# EAGLE design extruderControllerv03 (EAGLE 9.3.1)
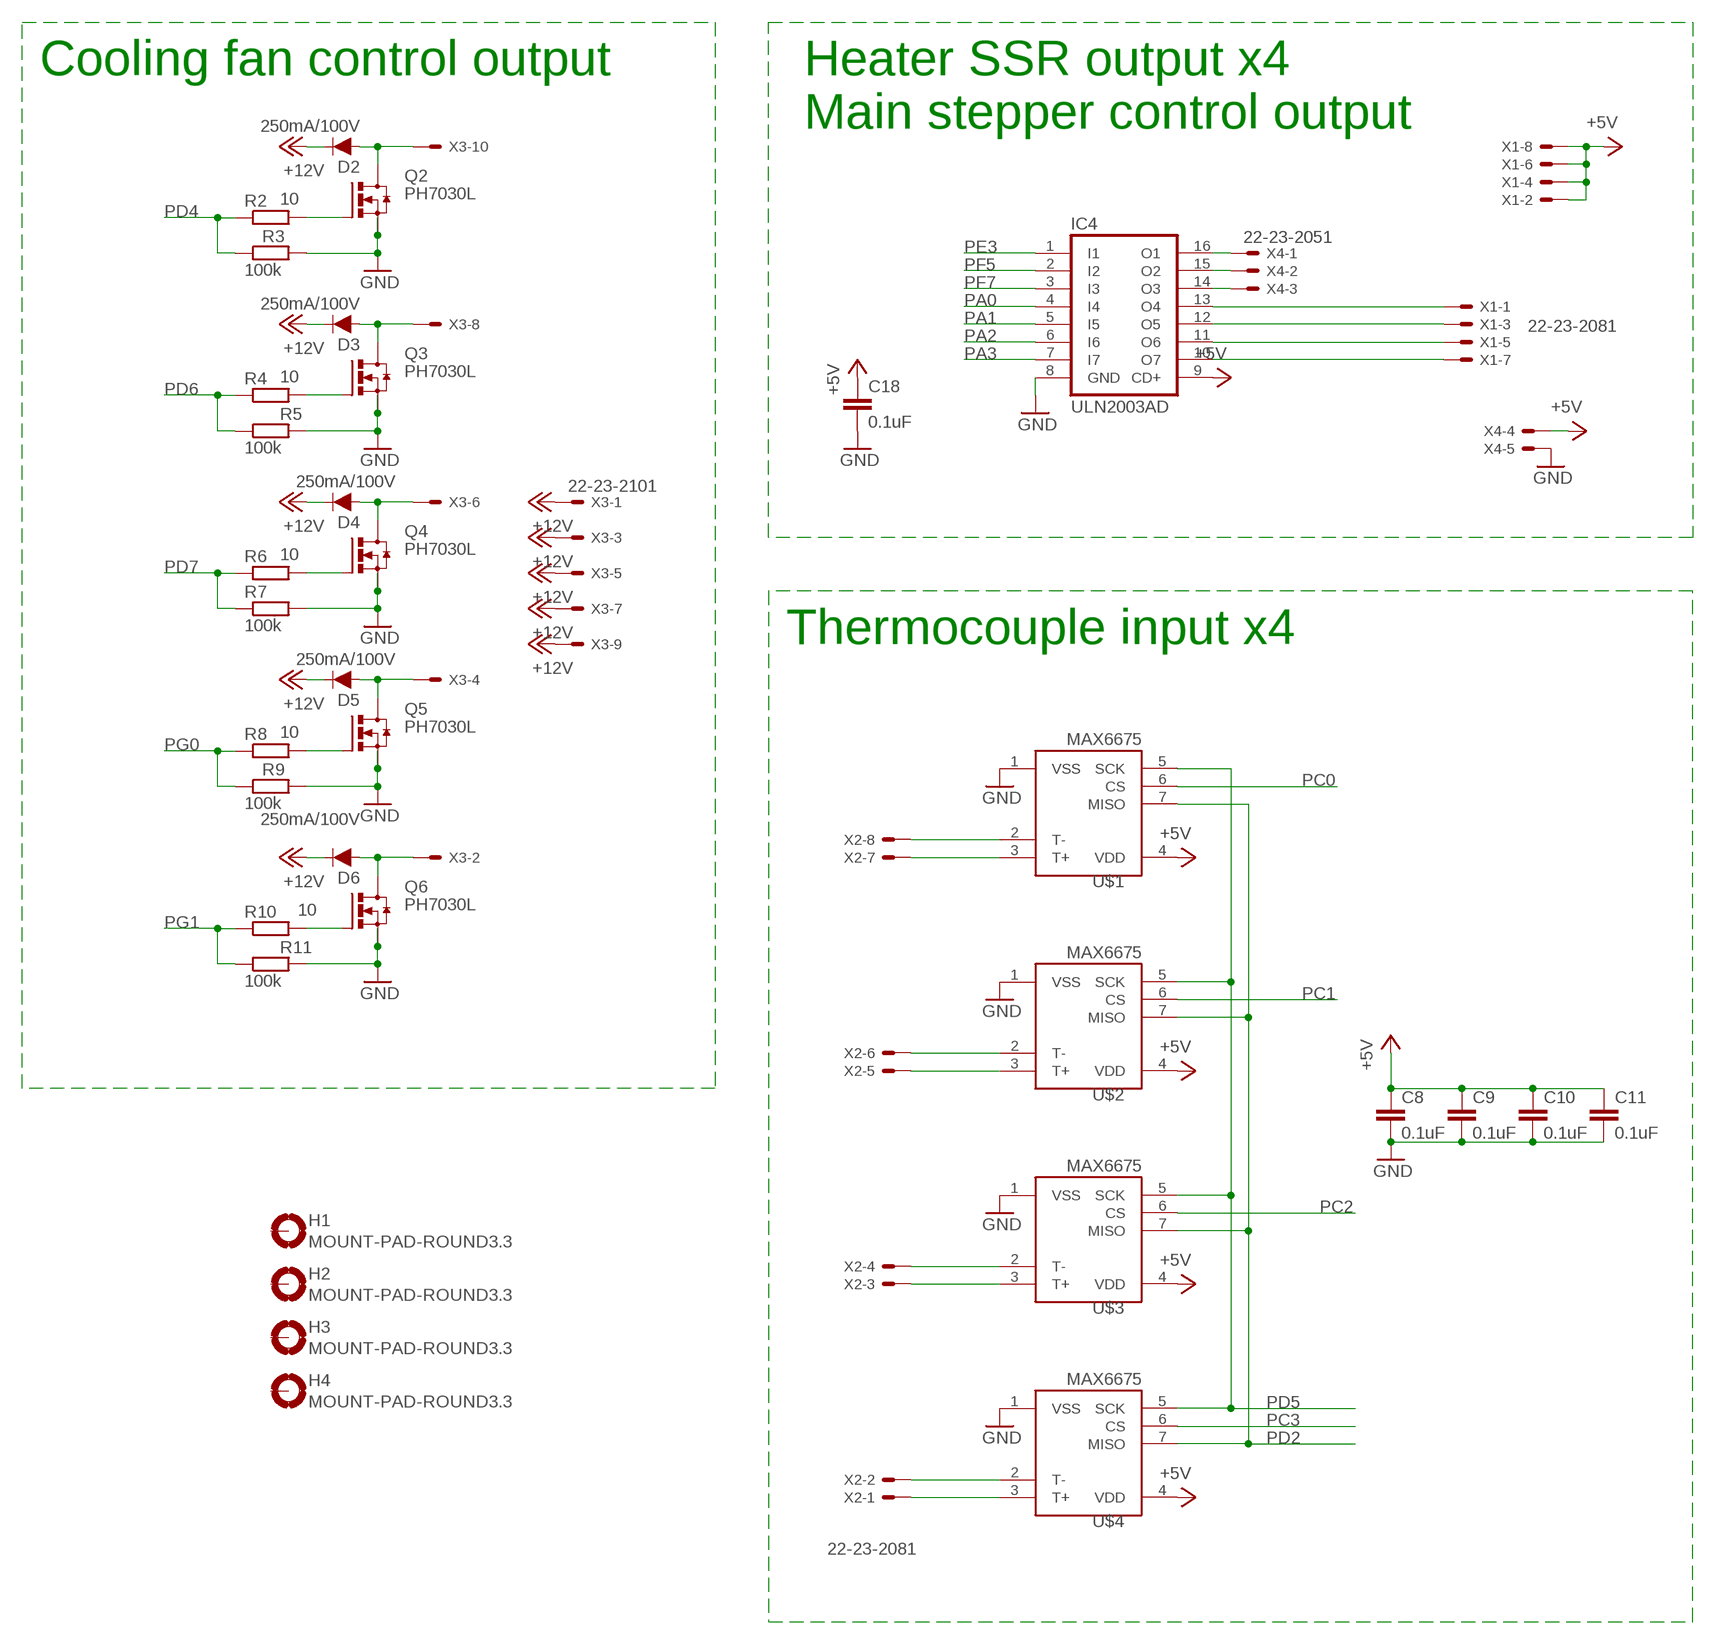
[diagram p0: schematic, sheet 1, part 1 of 2]
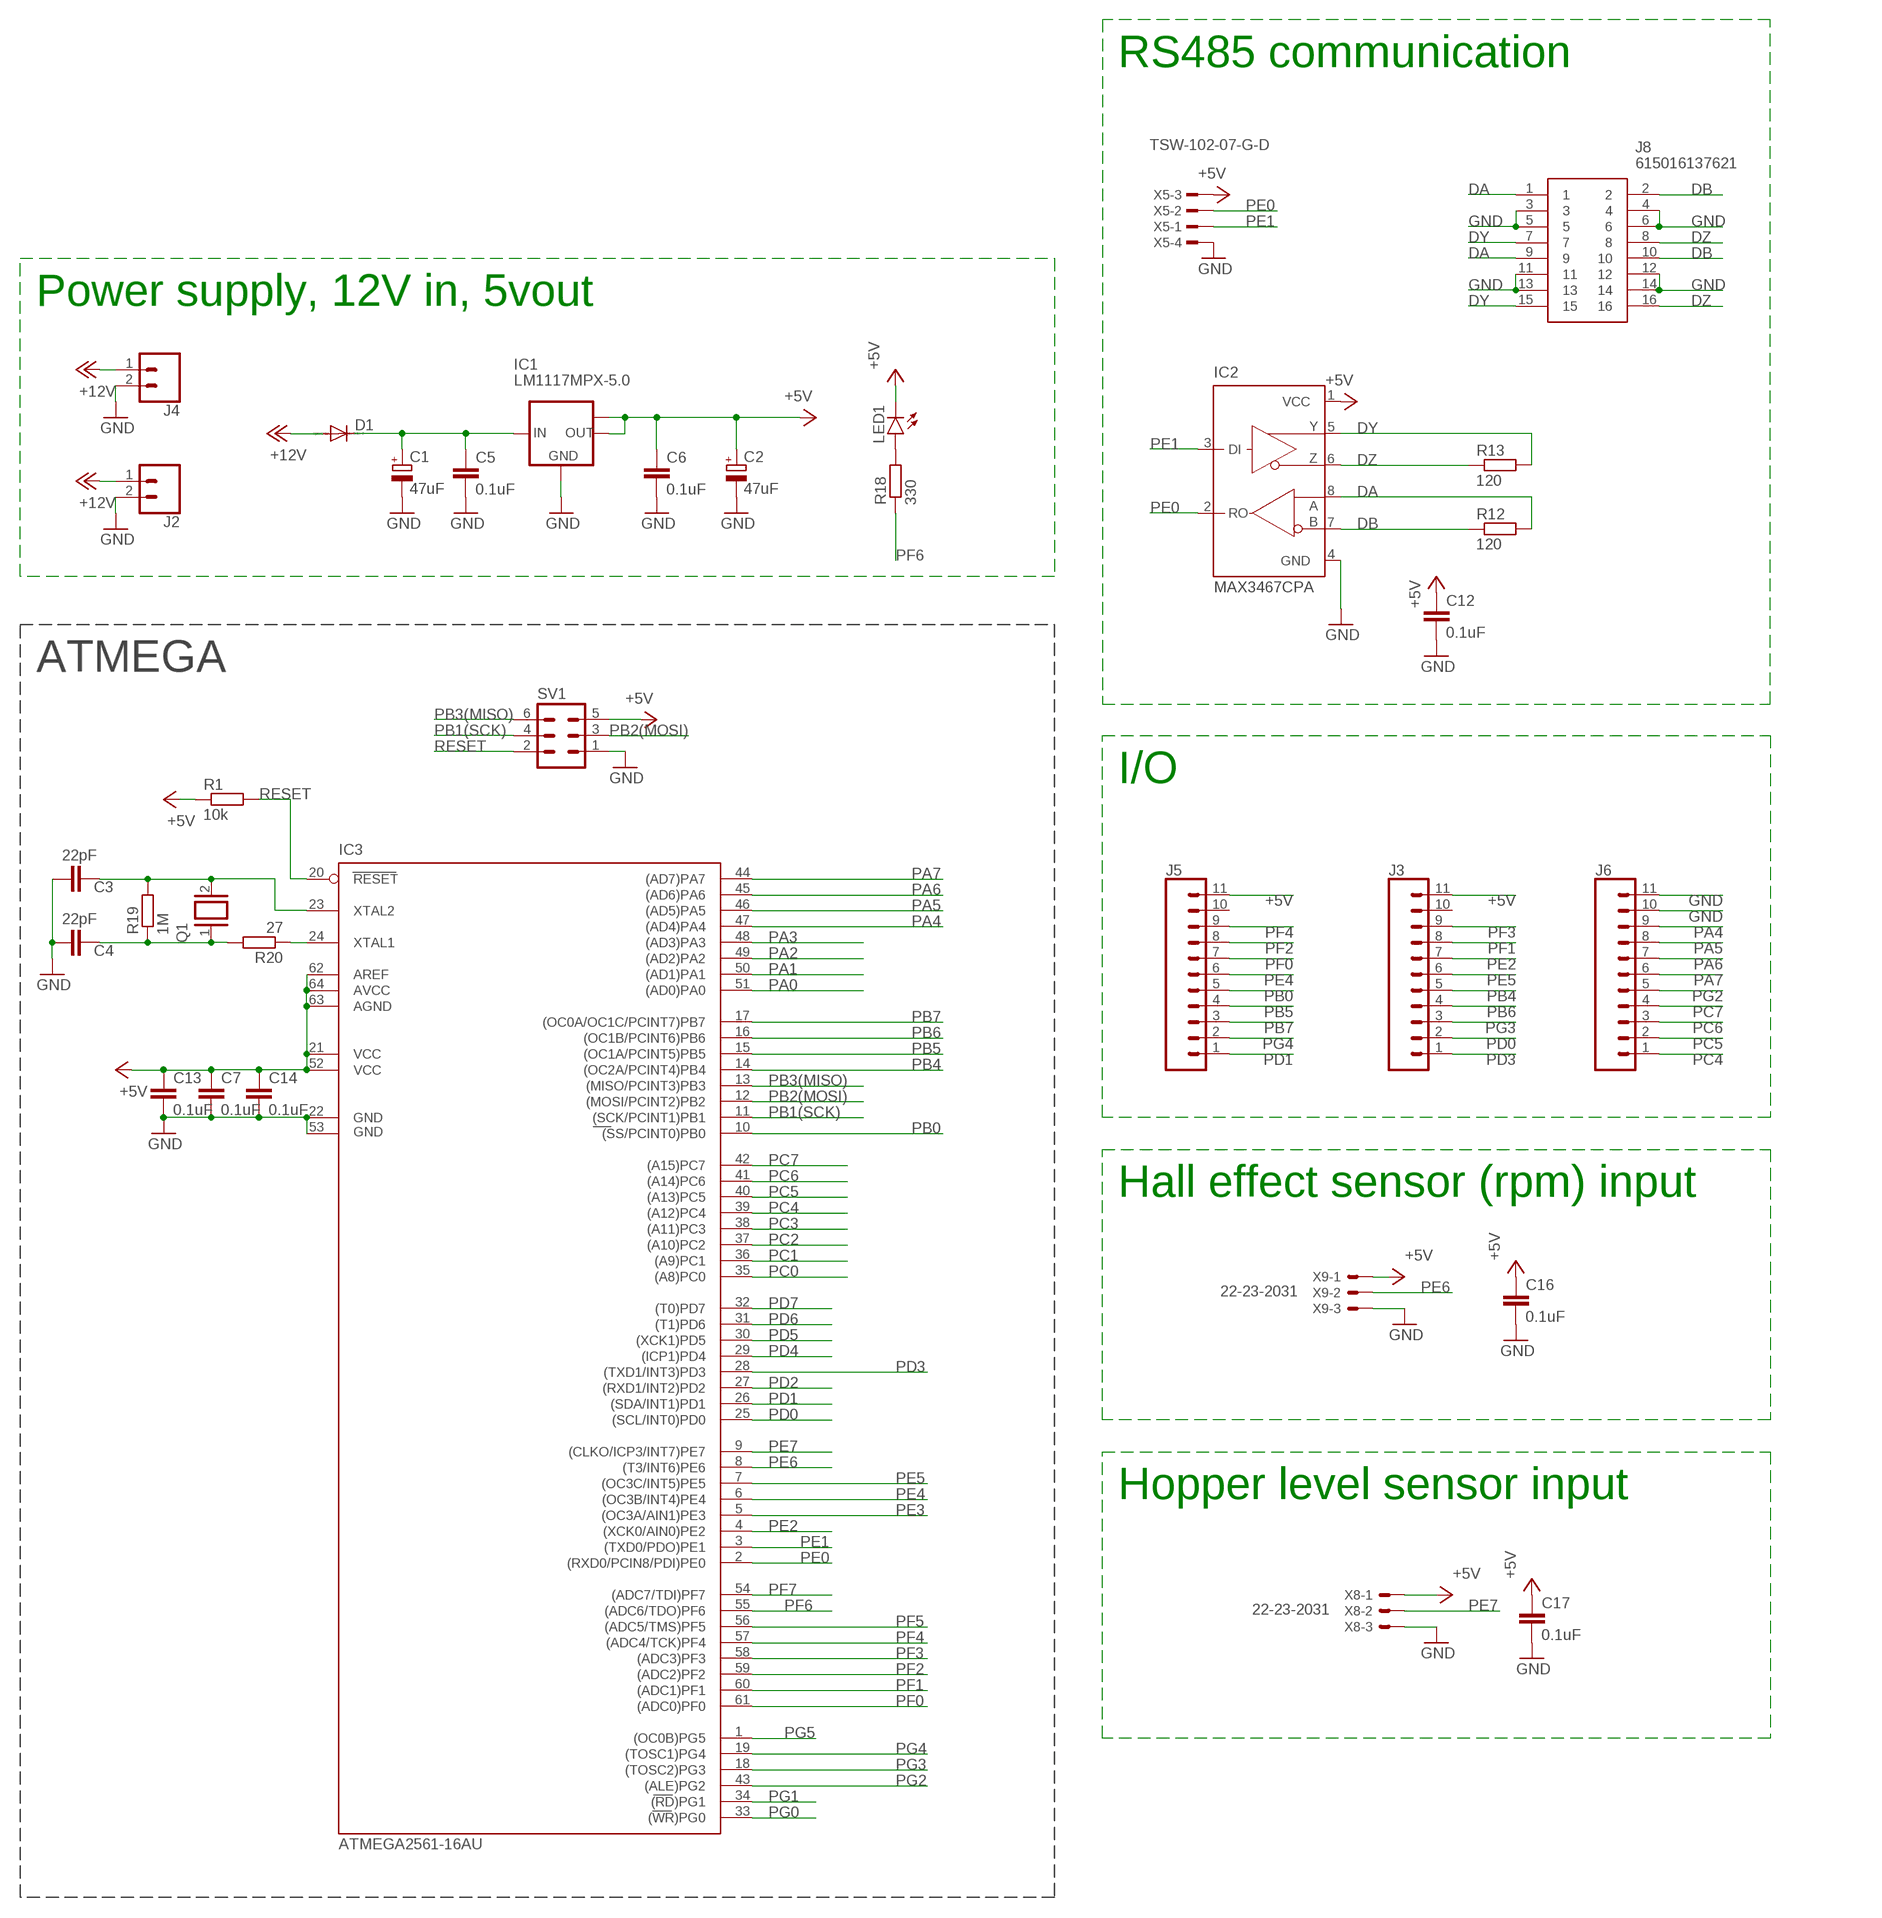
[diagram p1: schematic, sheet 1, part 2 of 2]

## Parts
C1  47uF  CPOL-EUD  [PANASONIC_D]
C2  47uF  CPOL-EUD  [PANASONIC_D]
C3  22pF  C-EUC0603  [C0603]
C4  22pF  C-EUC0603  [C0603]
C5  0.1uF  C-EUC0603  [C0603]
C6  0.1uF  C-EUC0603  [C0603]
C7  0.1uF  C-EUC0603  [C0603]
C8  0.1uF  C-EUC0603  [C0603]
C9  0.1uF  C-EUC0603  [C0603]
C10  0.1uF  C-EUC0603  [C0603]
C11  0.1uF  C-EUC0603  [C0603]
C12  0.1uF  C-EUC0603  [C0603]
C13  0.1uF  C-EUC0603  [C0603]
C14  0.1uF  C-EUC0603  [C0603]
C16  0.1uF  C-EUC0603  [C0603]
C17  0.1uF  C-EUC0603  [C0603]
C18  0.1uF  C-EUC0603  [C0603]
D1  DIODE-SMB  [SMB]
D2  250mA/100V  DIODE-BAS16J  [SOD-323]
D3  250mA/100V  DIODE-BAS16J  [SOD-323]
D4  250mA/100V  DIODE-BAS16J  [SOD-323]
D5  250mA/100V  DIODE-BAS16J  [SOD-323]
D6  250mA/100V  DIODE-BAS16J  [SOD-323]
H1  MOUNT-PAD-ROUND3.3  [3,3-PAD]
H2  MOUNT-PAD-ROUND3.3  [3,3-PAD]
H3  MOUNT-PAD-ROUND3.3  [3,3-PAD]
H4  MOUNT-PAD-ROUND3.3  [3,3-PAD]
IC1  LM1117MPX-5.0  [SOT223]
IC2  MAX3467CPA  [SO08]
IC3  ATMEGA2561-16AU  [TQFP64]
IC4  ULN2003AD  [SO16]
J2  CONN_023.5MM  [SCREWTERMINAL-3.5MM-2]
J3  CONN_11  [1X11]
J4  CONN_023.5MM  [SCREWTERMINAL-3.5MM-2]
J5  CONN_11  [1X11]
J6  CONN_11  [1X11]
J8  615016137621  [WR-MJ]
LED1  LEDSML1206  [SML1206]
Q1  XTAL/S  [QS]
Q2  PH7030L  [SOT669]
Q3  PH7030L  [SOT669]
Q4  PH7030L  [SOT669]
Q5  PH7030L  [SOT669]
Q6  PH7030L  [SOT669]
R1  10k  R-EU_R0805  [R0805]
R2  10  R-EU_R0805  [R0805]
R3  100k  R-EU_R0805  [R0805]
R4  10  R-EU_R0805  [R0805]
R5  100k  R-EU_R0805  [R0805]
R6  10  R-EU_R0805  [R0805]
R7  100k  R-EU_R0805  [R0805]
R8  10  R-EU_R0805  [R0805]
R9  100k  R-EU_R0805  [R0805]
R10  10  R-EU_R0805  [R0805]
R11  100k  R-EU_R0805  [R0805]
R12  120  R-EU_R1210  [R1210]
R13  120  R-EU_R1210  [R1210]
R18  330  R-EU_R0805  [R0805]
R19  1M  R-EU_R0805  [R0805]
R20  27  R-EU_R0805  [R0805]
SV1  MA03-2  [MA03-2]
U$1  MAX6675  [SO08-MAX6675]
U$2  MAX6675  [SO08-MAX6675]
U$3  MAX6675  [SO08-MAX6675]
U$4  MAX6675  [SO08-MAX6675]
X1  22-23-2081  [22-23-2081]
X2  22-23-2081  [22-23-2081]
X3  22-23-2101  [22-23-2101]
X4  22-23-2051  [22-23-2051]
X5  TSW-102-07-G-D  [TSW-102-XX-G-D]
X8  22-23-2031  [22-23-2031]
X9  22-23-2031  [22-23-2031]

## Nets
+5V: C2.+ C6.1 C7.1 C8.1 C9.1 C10.1 C11.1 C12.1 C13.1 C14.1 C16.1 C17.1 C18.1 IC1.2(OUT) IC1.TAB(OUT1) IC2.1(VCC) IC3.21(VCC) IC3.52(VCC1) IC3.62(AREF) IC3.63(AGND) IC3.64(AVCC) IC4.9(CD+) J3.11 J5.11 LED1.C R1.1 SV1.5 U$1.4(VDD) U$2.4(VDD) U$3.4(VDD) U$4.4(VDD) X1.2 X1.4 X1.6 X1.8 X4.4 X5.3 X8.1 X9.1
+12V: D1.A D2.C D3.C D4.C D5.C D6.C J2.1 J4.1 X3.1 X3.3 X3.5 X3.7 X3.9
DA: IC2.8(A) J8.1 J8.9 R12.2
DB: IC2.7(B) J8.2 J8.10 R12.1
DY: IC2.5(Y) J8.7 J8.15 R13.2
DZ: IC2.6(Z) J8.8 J8.16 R13.1
GND: C1.- C2.- C3.2 C4.2 C5.2 C6.2 C7.2 C8.2 C9.2 C10.2 C11.2 C12.2 C13.2 C14.2 C16.2 C17.2 C18.2 IC1.1(GND) IC2.4(GND) IC3.22(GND) IC3.53(GND1) IC4.8(GND) J2.2 J4.2 J6.10 J6.11 J8.3 J8.4 J8.5 J8.6 J8.11 J8.12 J8.13 J8.14 Q2.1(S) Q2.2(S) Q2.3(S) Q3.1(S) Q3.2(S) Q3.3(S) Q4.1(S) Q4.2(S) Q4.3(S) Q5.1(S) Q5.2(S) Q5.3(S) Q6.1(S) Q6.2(S) Q6.3(S) R3.2 R5.2 R7.2 R9.2 R11.2 SV1.1 U$1.1(VSS) U$2.1(VSS) U$3.1(VSS) U$4.1(VSS) X4.5 X5.4 X8.3 X9.3
N$2: Q2.4(G) R2.2
N$4: U$1.2(T-) X2.8
N$5: U$1.3(T+) X2.7
N$6: U$2.2(T-) X2.6
N$7: U$2.3(T+) X2.5
N$8: U$3.2(T-) X2.4
N$9: U$3.3(T+) X2.3
N$10: U$4.2(T-) X2.2
N$11: U$4.3(T+) X2.1
N$12: IC4.12(O5) X1.3
N$13: IC4.11(O6) X1.5
N$14: IC4.10(O7) X1.7
N$15: IC4.15(O2) X4.2
N$18: C1.+ C5.1 D1.C IC1.3(IN)
N$19: C3.1 IC3.23(XTAL2) Q1.2 R19.2
N$20: C4.1 Q1.1 R19.1 R20.2
N$21: IC4.14(O3) X4.3
N$22: D2.A Q2.MB(D) X3.10
N$23: Q3.4(G) R4.2
N$25: D3.A Q3.MB(D) X3.8
N$26: Q4.4(G) R6.2
N$27: IC4.16(O1) X4.1
N$28: D4.A Q4.MB(D) X3.6
N$29: Q5.4(G) R8.2
N$30: IC4.13(O4) X1.1
N$31: D5.A Q5.MB(D) X3.4
N$32: Q6.4(G) R10.2
N$34: D6.A Q6.MB(D) X3.2
N$35: IC3.24(XTAL1) R20.1
N$41: LED1.A R18.2
PA0: IC3.51((AD0)PA0) IC4.4(I4)
PA1: IC3.50((AD1)PA1) IC4.5(I5)
PA2: IC3.49((AD2)PA2) IC4.6(I6)
PA3: IC3.48((AD3)PA3) IC4.7(I7)
PA4: IC3.47((AD4)PA4) J6.9
PA5: IC3.46((AD5)PA5) J6.8
PA6: IC3.45((AD6)PA6) J6.7
PA7: IC3.44((AD7)PA7) J6.6
PB0: IC3.10((SS/PCINT0)PB0) J5.5
PB1(SCK): IC3.11((SCK/PCINT1)PB1) SV1.4
PB2(MOSI): IC3.12((MOSI/PCINT2)PB2) SV1.3
PB3(MISO): IC3.13((MISO/PCINT3)PB3) SV1.6
PB4: IC3.14((OC2A/PCINT4)PB4) J3.5
PB5: IC3.15((OC1A/PCINT5)PB5) J5.4
PB6: IC3.16((OC1B/PCINT6)PB6) J3.4
PB7: IC3.17((OC0A/OC1C/PCINT7)PB7) J5.3
PC0: IC3.35((A8)PC0) U$1.6(CS)
PC1: IC3.36((A9)PC1) U$2.6(CS)
PC2: IC3.37((A10)PC2) U$3.6(CS)
PC3: IC3.38((A11)PC3) U$4.6(CS)
PC4: IC3.39((A12)PC4) J6.1
PC5: IC3.40((A13)PC5) J6.2
PC6: IC3.41((A14)PC6) J6.3
PC7: IC3.42((A15)PC7) J6.4
PD0: IC3.25((SCL/INT0)PD0) J3.2
PD1: IC3.26((SDA/INT1)PD1) J5.1
PD2: IC3.27((RXD1/INT2)PD2) U$1.7(MISO) U$2.7(MISO) U$3.7(MISO) U$4.7(MISO)
PD3: IC3.28((TXD1/INT3)PD3) J3.1
PD4: IC3.29((ICP1)PD4) R2.1 R3.1
PD5: IC3.30((XCK1)PD5) U$1.5(SCK) U$2.5(SCK) U$3.5(SCK) U$4.5(SCK)
PD6: IC3.31((T1)PD6) R4.1 R5.1
PD7: IC3.32((T0)PD7) R6.1 R7.1
PE0: IC2.2(RO) IC3.2((RXD0/PCIN8/PDI)PE0) X5.2
PE1: IC2.3(DI) IC3.3((TXD0/PDO)PE1) X5.1
PE2: IC3.4((XCK0/AIN0)PE2) J3.7
PE3: IC3.5((OC3A/AIN1)PE3) IC4.1(I1)
PE4: IC3.6((OC3B/INT4)PE4) J5.6
PE5: IC3.7((OC3C/INT5)PE5) J3.6
PE6: IC3.8((T3/INT6)PE6) X9.2
PE7: IC3.9((CLKO/ICP3/INT7)PE7) X8.2
PF0: IC3.61((ADC0)PF0) J5.7
PF1: IC3.60((ADC1)PF1) J3.8
PF2: IC3.59((ADC2)PF2) J5.8
PF3: IC3.58((ADC3)PF3) J3.9
PF4: IC3.57((ADC4/TCK)PF4) J5.9
PF5: IC3.56((ADC5/TMS)PF5) IC4.2(I2)
PF6: IC3.55((ADC6/TDO)PF6) R18.1
PF7: IC3.54((ADC7/TDI)PF7) IC4.3(I3)
PG0: IC3.33((WR)PG0) R8.1 R9.1
PG1: IC3.34((RD)PG1) R10.1 R11.1
PG2: IC3.43((ALE)PG2) J6.5
PG3: IC3.18((TOSC2)PG3) J3.3
PG4: IC3.19((TOSC1)PG4) J5.2
PG5: IC3.1((OC0B)PG5)
RESET: IC3.20(RESET) R1.2 SV1.2
Unconnected: H1.B3,3(MOUNT) H2.B3,3(MOUNT) H3.B3,3(MOUNT) H4.B3,3(MOUNT) J3.10 J5.10

## Notes on the sheet
- RS485 communication
- Cooling fan control output | Heater SSR output x4 | Power supply, 12V in, 5vout
- Main stepper control output
- ATMEGA
- I/O
- Thermocouple input x4
- Hall effect sensor (rpm) input
- Hopper level sensor input

## Library data of the parts
C1 C2 = rcl:CPOL-EU: POLARIZED CAPACITOR, European symbol; SPICEPREFIX: C
C3-C14 C16-C18 = rcl:C-EU: CAPACITOR, European symbol; SPICEPREFIX: C
D1 = diode:DIODE-: DIODE
D2-D6 = SparkFun-DiscreteSemi:DIODE: Diode These are standard reverse protection diodes and small signal diodes. SparkFun Products: SparkFun SparkPunk Sound Kit <https://www.sparkfun.com/products/11177> SparkFun ESP8266 Thing <https://www.sparkfun.com/products/13231>; PROD_ID: DIO-09646
H1-H4 = holes:MOUNT-PAD-ROUND: MOUNTING PAD, round
IC1 = lm1117:LM1117MPX-*
IC2 = maxim:MAX3467*: +5V, Fail-Safe, 40Mbps, Profibus RS-485/RS-422 Transceivers Source: MAX3465-MAX3469.pdf; OC_FARNELL: unknown; OC_NEWARK: unknown
IC3 = atmel-2005:ATMEGA2561*: MICROCONTROLLER 256 Kbytes FLASH 4 Kbytes EEPROM 8 Kbytes SRAM 54 General Purpose I/O pins 6-channels 16-bit PWM 2 x Serial USARTs 8-channels 10-bit A/D
IC4 = uln-udn:ULN2003A: DRIVER ARRAY
J2 J4 = SparkFun-Connectors:CONN_02: Multi connection point. Often used as Generic Header-pin footprint for 0.1 inch spaced/style header connections On any of the 0.1 inch spaced packages, you can populate with these: Break Away Headers - Straight <https://www.sparkfun.com/products/116> (PRT-00116) Break Away Male Headers - Right Angle <https://www.sparkfun.com/products/553> (PRT-00553) Female Headers <https://www.sparkfun.com/products/115> (PRT-00115) Break Away Headers - Machine Pin <https://www.sparkfun.com/products/117> (PRT-00117) Break Away Female Headers - Swiss Machine Pin <https://www.sparkfun.com/products/743> (PRT-00743) For SCREWTERMINALS and SPRING TERMINALS visit here: Screw Terimnals on SparkFun.com <https://www.sparkfun.com/search/results?term=Screw+Terminals> (5mm/3.5mm/2.54mm spacing) This device is also useful as a general connection point to wire up your design to another part of your project. Our various solder wires solder well into these plated through hole pads. Hook-Up Wire - Assortment (Stranded, 22 AWG) <https://www.sparkfun.com/products/11375> (PRT-11375) Hook-Up Wire - Assortment (Solid Core, 22 AWG) <https://www.sparkfun.com/products/11367> (PRT-11367) View the entire wire category on our website here <https://www.sparkfun.com/categories/141> Special notes: Molex polarized connector foot print use with: PRT-08233 with associated crimp pins and housings. 2.54_SCREWTERM for use with PRT-10571. 3.5mm Screw Terminal footprints for PRT-08084 5mm Screw Terminal footprints for use with PRT-08432; PROD_ID: CONN-08399
J3 J5 J6 = SparkFun-Connectors:CONN_11: Multi connection point. Often used as Generic Header-pin footprint for 0.1 inch spaced/style header connections On any of the 0.1 inch spaced packages, you can populate with these: Break Away Headers - Straight <https://www.sparkfun.com/products/116> (PRT-00116) Break Away Male Headers - Right Angle <https://www.sparkfun.com/products/553> (PRT-00553) Female Headers <https://www.sparkfun.com/products/115> (PRT-00115) Break Away Headers - Machine Pin <https://www.sparkfun.com/products/117> (PRT-00117) Break Away Female Headers - Swiss Machine Pin <https://www.sparkfun.com/products/743> (PRT-00743) For SCREWTERMINALS and SPRING TERMINALS visit here: Screw Terimnals on SparkFun.com <https://www.sparkfun.com/search/results?term=Screw+Terminals> (5mm/3.5mm/2.54mm spacing) This device is also useful as a general connection point to wire up your design to another part of your project. Our various solder wires solder well into these plated through hole pads. Hook-Up Wire - Assortment (Stranded, 22 AWG) <https://www.sparkfun.com/products/11375> (PRT-11375) Hook-Up Wire - Assortment (Solid Core, 22 AWG) <https://www.sparkfun.com/products/11367> (PRT-11367) View the entire wire category on our website here <https://www.sparkfun.com/categories/141>
J8 = SamacSys_Parts:615016137621: Wurth Elektronik Female Cat5e RJ45 Connector, Shielded, Right Angle, PCB Mount Mount, Source: Datasheet <http://www.mouser.com/datasheet/2/445/615016137621-537831.pdf>; DESCRIPTION: Wurth Elektronik Female Cat5e RJ45 Connector, Shielded, Right Angle, PCB Mount Mount,; HEIGHT: mm; MANUFACTURER_NAME: Wurth Elektronik; MANUFACTURER_PART_NUMBER: 615016137621; MOUSER_PART_NUMBER: 710-615016137621; MOUSER_PRICE-STOCK: https://www.mouser.com/Search/Refine.aspx?Keyword=710-615016137621
LED1 = led:LED: LED OSRAM: - CHIPLED LG R971, LG N971, LY N971, LG Q971, LY Q971, LO R971, LY R971 LH N974, LH R974 LS Q976, LO Q976, LY Q976 LO Q996 - Hyper CHIPLED LW Q18S LB Q993, LB Q99A, LB R99A - SideLED LS A670, LO A670, LY A670, LG A670, LP A670 LB A673, LV A673, LT A673, LW A673 LH A674 LY A675 LS A676, LA A676, LO A676, LY A676, LW A676 LS A679, LY A679, LG A679 - Hyper Micro SIDELED® LS Y876, LA Y876, LO Y876, LY Y876 LT Y87S - SmartLED LW L88C, LW L88S LB L89C, LB L89S, LG L890 LS L89K, LO L89K, LY L89K LS L896, LA L896, LO L896, LY L896 - TOPLED LS T670, LO T670, LY T670, LG T670, LP T670 LSG T670, LSP T670, LSY T670, LOP T670, LYG T670 LG T671, LOG T671, LSG T671 LB T673, LV T673, LT T673, LW T673 LH T674 LS T676, LA T676, LO T676, LY T676, LB T676, LH T676, LSB T676, LW T676 LB T67C, LV T67C, LT T67C, LS T67K, LO T67K, LY T67K, LW E67C LS E67B, LA E67B, LO E67B, LY E67B, LB E67C, LV E67C, LT E67C LW T67C LS T679, LY T679, LG T679 LS T770, LO T770, LY T770, LG T770, LP T770 LB T773, LV T773, LT T773, LW T773 LH T774 LS E675, LA E675, LY E675, LS T675 LS T776, LA T776, LO T776, LY T776, LB T776 LHGB T686 LT T68C, LB T68C - Hyper Mini TOPLED® LB M676 - Mini TOPLED Santana® LG M470 LS M47K, LO M47K, LY M47K Source: http://www.osram.convergy.de LUXEON: - LUMILED® LXK2-PW12-R00, LXK2-PW12-S00, LXK2-PW14-U00, LXK2-PW14-V00 LXK2-PM12-R00, LXK2-PM12-S00, LXK2-PM14-U00 LXK2-PE12-Q00, LXK2-PE12-R00, LXK2-PE12-S00, LXK2-PE14-T00, LXK2-PE14-U00 LXK2-PB12-K00, LXK2-PB12-L00, LXK2-PB12-M00, LXK2-PB14-N00, LXK2-PB14-P00, LXK2-PB14-Q00 LXK2-PR12-L00, LXK2-PR12-M00, LXK2-PR14-Q00, LXK2-PR14-R00 LXK2-PD12-Q00, LXK2-PD12-R00, LXK2-PD12-S00 LXK2-PH12-R00, LXK2-PH12-S00 LXK2-PL12-P00, LXK2-PL12-Q00, LXK2-PL12-R00 Source: www.luxeon.com KINGBRIGHT: KA-3528ASYC Source: www.kingbright.com
Q1 = special:XTAL/S: CRYSTAL; SPICEPREFIX: B
Q2-Q6 = transistor-power:PH7030L: N-channel TrenchMOS (TM) logic level FET Source: http://www.nxp.com/acrobat_download/datasheets/PH7030L_4.pdf
R1-R13 R18-R20 = rcl:R-EU_: RESISTOR, European symbol; SPICEPREFIX: R
SV1 = con-lstb:MA03-2: PIN HEADER; OC_FARNELL: unknown; OC_NEWARK: unknown
U$1-U$4 = SparkFun-AnalogIC:MAX6675: K-type thermocouple ADC, SPI output
X1 X2 = con-molex:22-23-2081: .100" (2.54mm) Center Header - 8 Pin; MF: MOLEX; MPN: 22-23-2081; OC_FARNELL: 1756826; OC_NEWARK: 01C7592
X3 = con-molex:22-23-2101: .100" (2.54mm) Center Header - 10 Pin; MF: MOLEX; MPN: 22-23-2101; OC_FARNELL: 1756828; OC_NEWARK: 94C0765
X4 = con-molex:22-23-2051: .100" (2.54mm) Center Header - 5 Pin; MF: MOLEX; MPN: 22-23-2051; OC_FARNELL: 1462952; OC_NEWARK: 38C9178
X5 = con-samtec:TSW-102-*-G: THROUGH-HOLE .025" SQ POST HEADER Source: Samtec TSW.pdf; MF: Samtec Inc.; MPN: TSW-102-07-G-D
X8 X9 = con-molex:22-23-2031: .100" (2.54mm) Center Header - 3 Pin; MF: MOLEX; MPN: 22-23-2031; OC_FARNELL: 1462950; OC_NEWARK: 30C0862

## Board
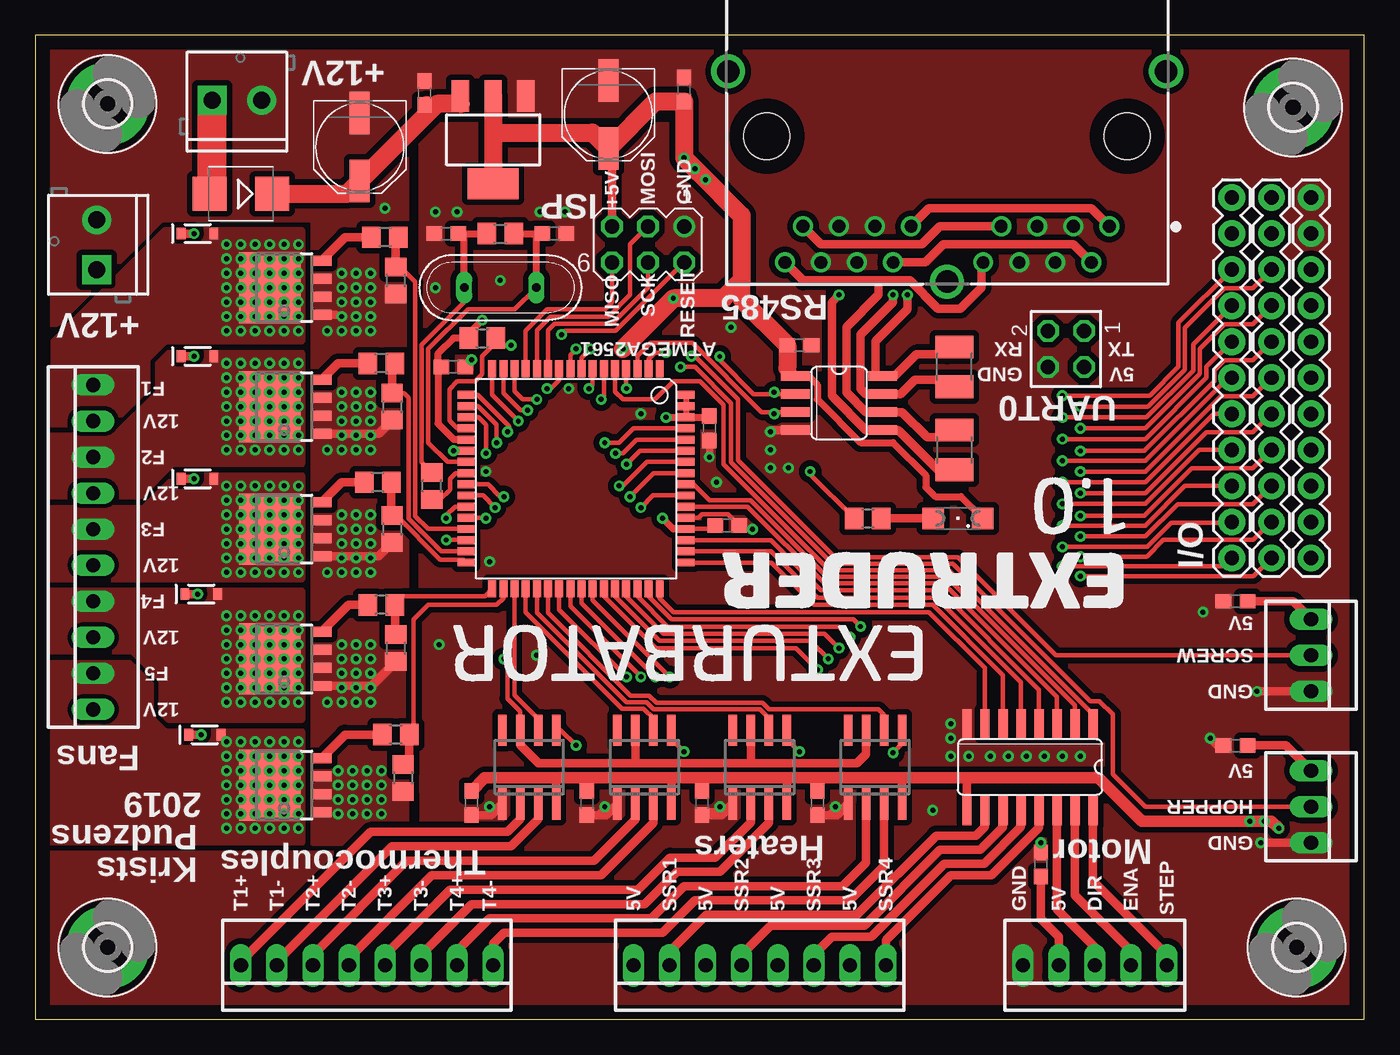
[diagram p2: board, top side]
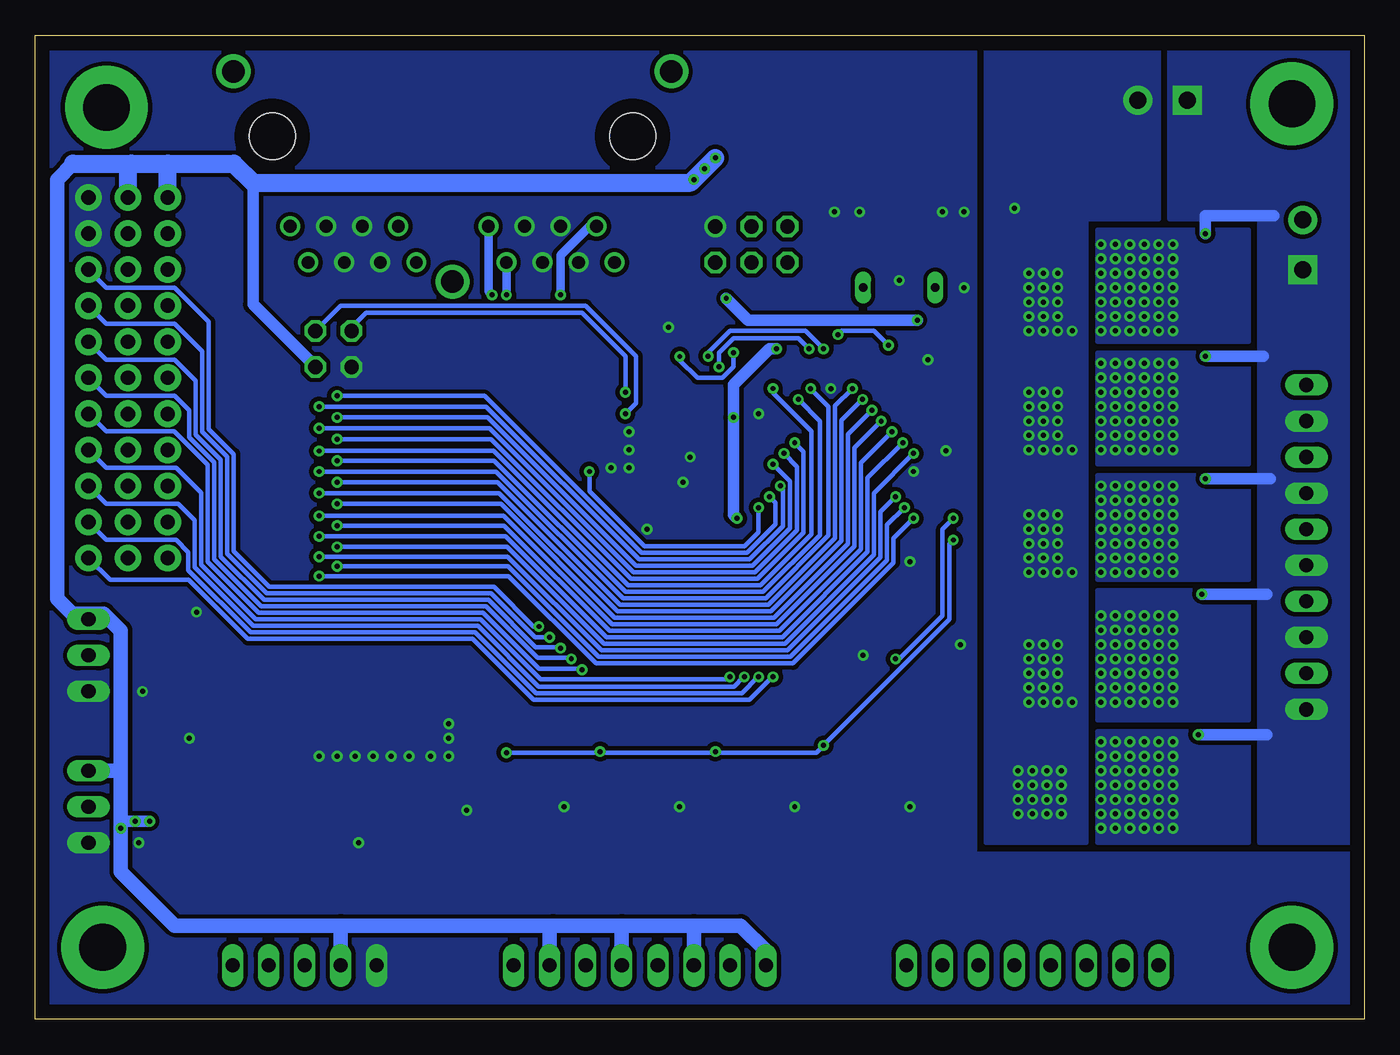
[diagram p3: board, bottom side, seen from below]

Size 93.65 x 69.33 mm. Coordinates in mm from the lower left corner, seen from the top.
Outline: 0,0 93.65,0 93.65,69.33 0,69.33 0,0
Copper layers (1*16): Top 0.035mm / dielectric 1.5mm / Bottom 0.035mm
Design rules "default *": minimum track width 6mil, minimum drill 0.35mm, track to track 6mil, track to pad 6mil, pad to pad 6mil, via to via 6mil, smd to smd 6mil, copper to edge 40mil, drill to drill 6mil, minimum pad ring 10mil, minimum via ring 8mil, stop-mask expansion 4mil, vias tented up to drill 25mil, thermal gap 10mil

### Footprints (pad centres in the part's own frame; a part is rotated, then mirrored left to right if it is on the bottom)
PANASONIC_D = smd 3 x 1.4: + 2.4,0; - -2.4,0
C0603 = smd 1.1 x 1: 1 -0.85,0; 2 0.85,0
SMB = smd 2.4 x 2.4: A 2.2,0; C -2.2,0
SOD-323 = smd 0.63 x 0.83: A 1.15,0; C -1.15,0
3,3-PAD = drill 3.3 pad 5.842: B3,3 0,0
SOT223 = smd 1.219 x 2.235: 1 -2.311,-3.099; 2 0,-3.099; 3 2.311,-3.099 | smd 3.6 x 2.2: TAB 0,3.099
SO08 = smd 0.66 x 2.032: 1 -1.905,-3.073; 2 -0.635,-3.073; 3 0.635,-3.073; 4 1.905,-3.073; 5 1.905,3.073; 6 0.635,3.073; 7 -0.635,3.073; 8 -1.905,3.073
TQFP64 = smd 1.194 x 0.559: 1 -7.76,5.905; 2 -7.76,5.118; 3 -7.76,4.331; 4 -7.76,3.543; 5 -7.76,2.756; 6 -7.76,1.968; 7 -7.76,1.181; 8 -7.76,0.394; 9 -7.76,-0.394; 10 -7.76,-1.181; 11 -7.76,-1.968; 12 -7.76,-2.756; 13 -7.76,-3.543; 14 -7.76,-4.331; 15 -7.76,-5.118; 16 -7.76,-5.905; 33 7.76,-5.905; 34 7.76,-5.118; 35 7.76,-4.331; 36 7.76,-3.543; 37 7.76,-2.756; 38 7.76,-1.968; 39 7.76,-1.181; 40 7.76,-0.394; 41 7.76,0.394; 42 7.76,1.181; 43 7.76,1.968; 44 7.76,2.756; 45 7.76,3.543; 46 7.76,4.331; 47 7.76,5.118; 48 7.76,5.905 | smd 0.559 x 1.194: 17 -5.905,-7.76; 18 -5.118,-7.76; 19 -4.331,-7.76; 20 -3.543,-7.76; 21 -2.756,-7.76; 22 -1.968,-7.76; 23 -1.181,-7.76; 24 -0.394,-7.76; 25 0.394,-7.76; 26 1.181,-7.76; 27 1.968,-7.76; 28 2.756,-7.76; 29 3.543,-7.76; 30 4.331,-7.76; 31 5.118,-7.76; 32 5.905,-7.76; 49 5.905,7.76; 50 5.118,7.76; 51 4.331,7.76; 52 3.543,7.76; 53 2.756,7.76; 54 1.968,7.76; 55 1.181,7.76; 56 0.394,7.76; 57 -0.394,7.76; 58 -1.181,7.76; 59 -1.968,7.76; 60 -2.756,7.76; 61 -3.543,7.76; 62 -4.331,7.76; 63 -5.118,7.76; 64 -5.905,7.76
SO16 = smd 0.66 x 2.032: 1 -4.445,-3.073; 2 -3.175,-3.073; 3 -1.905,-3.073; 4 -0.635,-3.073; 5 0.635,-3.073; 6 1.905,-3.073; 7 3.175,-3.073; 8 4.445,-3.073; 9 4.445,3.073; 10 3.175,3.073; 11 1.905,3.073; 12 0.635,3.073; 13 -0.635,3.073; 14 -1.905,3.073; 15 -3.175,3.073; 16 -4.445,3.073
SCREWTERMINAL-3.5MM-2 = drill 1.2 pad 2.032 square: 1 0,0 | drill 1.2 pad 2.032: 2 3.5,0
1X11 = drill 1.016 pad 1.88: 1 0,0; 2 2.54,0; 3 5.08,0; 4 7.62,0; 5 10.16,0; 6 12.7,0; 7 15.24,0; 8 17.78,0; 9 20.32,0; 10 22.86,0; 11 25.4,0
WR-MJ = drill 0.9 pad 1.4: 1 -11.43,10.92; 2 -10.16,13.46; 3 -8.89,10.92; 4 -7.62,13.46; 5 -6.35,10.92; 6 -5.08,13.46; 7 -3.81,10.92; 8 -2.54,13.46; 9 2.54,10.92; 10 3.81,13.46; 11 5.08,10.92; 12 6.35,13.46; 13 7.62,10.92; 14 8.89,13.46; 15 10.16,10.92; 16 11.43,13.46 | drill 1.6 pad 2.4: 17 0,14.81; 20 15.435,0; 21 -15.435,0 | hole 3.25: -12.7,4.57; 12.7,4.57
SML1206 = smd 1.5 x 1.5: A 1.75,0; C -1.75,0
QS = drill 0.61 long: 1 -2.54,0; 2 2.54,0
SOT669 = smd 0.7 x 1.4: 1 -1.905,-2.65; 2 -0.635,-2.65; 3 0.635,-2.65; 4 1.905,-2.65 | smd 5 x 4.3: MB 0,1
R0805 = smd 1.3 x 1.5: 1 -0.95,0; 2 0.95,0
R1210 = smd 1.6 x 2.7: 1 -1.4,0; 2 1.4,0
MA03-2 = drill 1.016: 1 -2.54,-1.27 | drill 1.016 octagon: 2 -2.54,1.27; 3 0,-1.27; 4 0,1.27; 5 2.54,-1.27; 6 2.54,1.27
SO08-MAX6675 = smd 0.6 x 2.2: 1 -1.905,-2.6; 2 -0.635,-2.6; 3 0.635,-2.6; 4 1.905,-2.6; 5 1.905,2.6; 6 0.635,2.6; 7 -0.635,2.6; 8 -1.905,2.6
22-23-2081 = drill 1 long: 1 -8.89,0; 2 -6.35,0; 3 -3.81,0; 4 -1.27,0; 5 1.27,0; 6 3.81,0; 7 6.35,0; 8 8.89,0
22-23-2101 = drill 1 long: 1 -11.43,0; 2 -8.89,0; 3 -6.35,0; 4 -3.81,0; 5 -1.27,0; 6 1.27,0; 7 3.81,0; 8 6.35,0; 9 8.89,0; 10 11.43,0
22-23-2051 = drill 1 long: 1 -5.08,0; 2 -2.54,0; 3 0,0; 4 2.54,0; 5 5.08,0
TSW-102-XX-G-D = drill 1 pad 1.5 octagon: 1 1.27,-1.27; 2 1.27,1.27; 3 -1.27,-1.27; 4 -1.27,1.27
22-23-2031 = drill 1 long: 1 -2.54,0; 2 0,0; 3 2.54,0

### Placement (x,y rotation side)
C1  22.86,61.47 270 top
C2  40.39,63.75 270 top
C3  36.58,55.37 0 top
C4  28.96,55.37 180 top
C5  27.43,65.28 90 top
C6  45.72,65.53 90 top
C7  29.46,45.97 0 top
C8  30.73,15.24 270 top
C9  38.86,15.24 270 top
C10  46.99,15.24 270 top
C11  55.12,15.24 270 top
C12  53.85,47.5 0 top
C13  48.77,34.8 0 top
C14  47.5,41.66 270 top
C16  84.58,29.46 180 top
C17  84.58,19.3 180 top
C18  70.87,10.92 90 top
D1  14.48,58.17 180 top
D2  11.43,55.37 0 top
D3  11.43,46.74 0 top
D4  11.43,38.1 0 top
D5  11.68,29.97 0 top
D6  11.94,20.07 0 top
H1  5.08,64.52 0 top
H2  5.08,5.08 0 top
H3  88.9,5.08 0 top
H4  88.65,64.26 0 top
IC1  32.26,61.98 180 top
IC2  56.64,43.43 270 top
IC3  38.1,38.1 270 top
IC4  70.1,17.78 180 top
J2  12.45,64.77 0 top
J3  87.12,32.51 90 top
J4  4.32,52.83 90 top
J5  84.33,32.51 90 top
J6  89.92,32.51 90 top
J8  64.26,66.8 180 top
LED1  65.02,35.31 180 top
Q1  32.77,51.56 0 top
Q2  17.53,51.56 90 top
Q3  17.53,43.18 90 top
Q4  17.53,34.54 90 top
Q5  17.53,25.4 90 top
Q6  17.53,16.51 90 top
R1  31.5,48.01 0 top
R2  24.64,55.12 180 top
R3  25.4,52.07 270 top
R4  24.38,46.23 180 top
R5  25.15,43.18 270 top
R6  24.13,37.85 180 top
R7  25.15,34.54 270 top
R8  24.38,29.21 180 top
R9  25.4,26.16 270 top
R10  25.4,20.07 180 top
R11  25.91,17.02 270 top
R12  64.77,45.97 90 top
R13  64.77,40.13 270 top
R18  58.67,35.31 0 top
R19  32.77,55.37 0 top
R20  27.94,37.59 90 top
SV1  43.18,54.61 180 top
U$1  34.8,17.78 0 top
U$2  42.93,17.78 0 top
U$3  51.05,17.78 0 top
U$4  59.18,17.78 0 top
X1  51.05,3.81 180 top
X2  23.37,3.81 180 top
X3  4.06,33.27 90 top
X4  74.68,3.81 180 top
X5  72.64,47.24 90 top
X8  89.92,25.65 270 top
X9  89.92,14.99 270 top

### Tracks (layer width: path | path; a pad name or v marks a point on that pad's centre or on a via)
+5V  (via drill 0.35)
  Top 0.305: IC3.52 47.68,34.56 C13.1 | 61.09,17.02 60.45,17.02 | IC3.63 IC3.64
  Top 0.406: IC3.64 IC3.62
  Top 0.508: IC3.52 44.95,34.56 v44.2,35.31 | v44.45,42.42 44.46,42.43 IC3.62 47.42,42.43 C14.1 | IC3.21 29.5,40.86 28.37,41.99 28.37,45.73 C7.1 28.36,46.23 28.36,46.9 29.46,48.01 R1.1 30.55,48.33 v31.5,49.28 | IC2.1 54.48,45.34 55.12,44.7 55.12,43.69 58.17,40.64 60.45,40.64 62.76,38.33 62.76,37.51 63.44,36.83 65.25,36.83 LED1.C
  Top 0.61: U$4.4 61.09,17.02 | U$3.4 52.96,16.89 52.83,17.02 | C11.1 55.12,17.02 | C10.1 46.99,16.76 46.74,17.02 | U$2.4 44.83,17.02 | C9.1 38.86,17.02 | U$1.4 36.7,16.89 36.58,17.02 | IC4.9 65.66,17.02 | C17.1 88.14,19.3 X9.1 | C16.1 88.65,29.46 X8.1 | SV1.5 40.64,61.1 C2.+ | IC2.1 53,45.91 | v47.24,59.18 46.74,59.69 v46.48,59.94 | C18.1 70.87,7.03 70.95,7.02 72.14,5.84 X4.4
  Top 0.813: C8.1 31.66,17.02 36.58,17.02 38.86,17.02 44.83,17.02 46.74,17.02 52.83,17.02 55.12,17.02 60.45,17.02 65.66,17.02 74.93,17.02 77.98,13.97 v85.6,13.97 v86.61,13.97 87.12,13.97 v87.63,13.46
  Top 1.27: IC1.2 32.26,62.48 | 32.26,62.48 IC1.TAB | 32.26,62.48 39.26,62.48 C2.+ 43.71,64.68 C6.1 v45.72,60.71 46.74,59.69 49.78,56.64 49.78,52.07 | 49.78,52.07 48.51,50.8 v44.96,50.8 v41.4,47.24 | 49.78,52.07 49.78,50.71 C12.1 53,45.91
  Bottom 0.305: 87.12,13.97 v87.63,13.46 87.63,11.18
  Bottom 0.61: 91.08,28.59 90.68,28.19 X8.1
  Bottom 0.813: v85.6,13.97 87.12,13.97 | v44.96,50.8 43.43,49.28 v31.5,49.28 | v44.2,35.31 44.45,35.56 v44.45,42.42 44.45,44.7 41.91,47.24 v41.4,47.24 | 78.32,58.96 78.32,50.38 X5.3
  Bottom 1.016: 91.01,60.3 92.13,59.18 92.13,29.64 91.08,28.59 88.83,28.59 87.63,27.39 87.63,17.78 | 87.63,17.78 87.63,11.18 87.63,10.41 83.82,6.6 72.14,6.6 | 72.14,6.6 57.15,6.6 | 57.15,6.6 52.32,6.6 | 52.32,6.6 47.24,6.6 | 47.24,6.6 43.94,6.6 42.16,4.83 X1.8 | X1.6 47.24,6.6 | X1.4 52.32,6.6 | X1.2 57.4,6.35 57.15,6.6 | X9.1 87.88,17.53 87.63,17.78 | X4.4 72.14,6.6
  Bottom 1.27: 91.01,60.3 86.87,60.3 | 86.87,60.3 84.33,60.3 | J5.11 84.33,60.3 | J3.11 87.12,60.05 86.87,60.3 | 84.33,60.3 79.66,60.3 78.32,58.96 47.47,58.96 v45.72,60.71
+12V  (via drill 0.35)
  Top 0.61: D2.C v11.18,55.37 | D3.C v11.18,46.74 | D4.C v11.18,38.1 | D5.C v11.43,29.97 | D6.C v11.68,20.07 | D1.A 12.45,58.33
  Top 2.032: 12.45,58.33 J2.1
  Bottom 0.813: v11.18,55.37 11.18,56.64 6.35,56.64 | v11.18,46.74 7.11,46.74 | v11.18,38.1 6.6,38.1 | v11.43,29.97 6.86,29.97 | v11.68,20.07 6.86,20.07
  pour Bottom (isolate 0.305, no thermals): 0.25,68.33 13.72,68.33 13.72,56.39 7.37,56.39 7.37,12.45 0.25,12.45
DA  (via drill 0.35)
  Top 0.61: J8.9 62.99,57.15 74.42,57.15 J8.1 | v61.47,51.05 61.47,50.04 59.21,47.78 59.21,45.34 IC2.8 60.58,45.34 62.11,46.87 64.26,46.87 R12.2
  Bottom 0.61: v61.47,51.05 61.72,51.31 J8.9
DB  (via drill 0.35)
  Top 0.61: J8.10 62.74,53.34 64.01,54.61 73.15,54.61 J8.2 | v60.45,51.05 60.45,50.55 58.17,48.26 58.17,44.45 58.55,44.07 IC2.7 60.96,44.07 61.98,45.08 64.26,45.08 R12.1
  Bottom 0.61: J8.10 v60.45,51.05
DY  (via drill 0.35)
  Top 0.61: J8.7 63.76,55.88 62.48,54.61 55.37,54.61 J8.15 | R13.2 63.63,38.73 60.83,41.53 IC2.5 58.55,41.53 56.13,43.94 56.13,50.55 v56.64,51.05
  Bottom 0.61: v56.64,51.05 56.64,53.85 54.61,55.88 J8.15
DZ
  Top 0.61: J8.16 54.1,52.07 59.44,52.07 | J8.8 66.68,53.22 66.68,51.56 65.2,50.08 63.62,50.08 61.63,52.07 59.44,52.07 | R13.1 64.26,41.02 62.86,41.02 61.09,42.8 IC2.6 58.55,42.8 57.15,44.2 57.15,48.77 59.44,51.05 59.44,52.07
GND  (via drill 0.35)
  Top 0.305: v56.39,14.99 55.88,14.48 55.21,14.48 C11.2 | v48.26,14.99 48.01,14.73 47.33,14.73 C10.2 | v40.13,14.99 39.62,14.48 38.95,14.48 C9.2 | U$1.1 32.35,14.64 v32,14.99 | IC3.53 46.73,35.34 46.99,35.6 48.81,35.6 C13.2
  Top 0.508: C14.2 v47.5,39.62 | IC3.22 v29.48,40.07
  Top 0.61: C8.2 32.1,14.39 U$1.1 | C9.2 40.23,14.39 U$2.1 | C10.2 48.36,14.39 U$3.1 | C11.2 56.49,14.39 U$4.1 | X8.3 v86.11,23.11 | X9.3 v86.36,12.45 | C17.2 83.31,19.3 v82.8,19.81 | v70.87,12.45 C18.2 | Q2.1 21.14,49.66 | Q3.1 24.19,41.27 R5.2 | Q4.1 24.19,32.64 R7.2 | Q5.1 23.68,23.5 R9.2 | IC2.4 51.94,41.53 v51.82,41.4
  other vias: 82.3,28.7 20.57,48.51 21.59,49.53 21.59,50.55 20.57,40.13 21.59,41.15 22.61,41.15 20.57,31.5 21.59,31.5 22.61,32.51 20.57,22.35 21.59,22.35 23.62,22.35 23.37,14.48 21.34,15.49 22.35,14.48 50.55,34.54 48.01,37.85 21.59,48.51 22.61,40.13 21.59,32.51 21.59,23.37 21.34,14.48 22.61,22.35 22.61,31.5 21.59,40.13 21.59,51.56 22.35,15.49 22.61,48.51 22.61,49.53 22.61,50.55 23.62,48.51 22.61,51.56 23.62,49.53 23.62,50.55 23.62,51.56 23.62,52.58 22.61,52.58 21.59,52.58 23.62,40.13 23.62,41.15 23.62,42.16 23.62,43.18 23.62,44.2 21.59,42.16 22.61,42.16 22.61,43.18 21.59,43.18 21.59,44.2 22.61,44.2 30.73,46.48 21.59,33.53 21.59,34.54 21.59,35.56 23.62,31.5 23.62,32.51 23.62,33.53 22.61,33.53 22.61,34.54 23.62,34.54 23.62,35.56 22.61,35.56 22.61,23.37 23.62,23.37 23.62,24.38 22.61,24.38 21.59,24.38 21.59,25.4 21.59,26.42 22.61,26.42 22.61,25.4 23.62,25.4 23.62,26.42 24.38,14.48 23.37,15.49 24.38,15.49 21.34,16.51 21.34,17.53 22.35,17.53 22.35,16.51 23.37,17.53 23.37,16.51 24.38,16.51 24.38,17.53 37.34,56.9 32.77,52.07 28.19,56.9 51.82,40.13 51.82,38.86 53.09,38.86 32,32.26 24.64,57.15 37.59,44.45 31.75,38.61 42.67,42.67 28.45,26.42 35.31,25.65 49.02,48.77 28.19,51.56 35.56,56.9 29.72,56.9 65.79,18.54 67.31,18.54 68.58,18.54 69.85,18.54 71.12,18.54 72.39,18.54 73.66,18.54 64.52,18.54 64.52,19.81 64.52,20.83 63.25,14.73
  pour Bottom (isolate 0.305, no thermals): 27.43,68.33 93.47,68.33 93.47,0.25 0.25,0.25 0.25,11.68 27.43,11.68
  pour Top (isolate 0.406, no thermals): 93.47,0.25 93.47,69.34 0.25,69.34 0.25,49.02 1.52,49.02 8.89,56.39 19.56,56.39 19.56,12.45 26.16,12.45 26.16,63.75 46.23,63.75 46.23,62.99 27.18,62.99 27.18,19.3 27.31,12.57 26.42,11.68 0.25,11.68 0.25,0.25
  pour Bottom (isolate 0.305, no thermals): 26.67,68.33 26.67,12.45 19.56,12.45 19.56,56.39 14.48,56.39 14.48,68.33
N$2
  Top 0.61: Q2.4 21.83,55.12 R2.2
N$4
  Top 0.61: U$1.2 34.16,14.1 33.27,13.21 23.62,13.21 14.48,4.06 X2.8
N$5
  Top 0.61: X2.7 17.02,4.06 25.15,12.19 33.53,12.19 35.43,14.1 U$1.3
N$6
  Top 0.61: X2.6 19.56,4.57 26.16,11.18 39.37,11.18 42.29,14.1 U$2.2
N$7
  Top 0.61: X2.5 22.1,4.32 27.94,10.16 39.88,10.16 43.56,13.84 U$2.3
N$8
  Top 0.61: X2.4 24.64,4.57 29.21,9.14 42.48,9.14 44.73,11.4 47.91,11.4 50.42,13.9 U$3.2
N$9
  Top 0.61: X2.3 27.18,4.57 30.73,8.13 42.93,8.13 45.21,10.41 48.26,10.41 51.69,13.84 U$3.3
N$10
  Top 0.61: X2.2 29.72,4.83 32,7.11 43.43,7.11 45.72,9.4 56.9,9.4 58.55,11.05 U$4.2
N$11
  Top 0.61: X2.1 32.26,5.33 33.02,6.1 44.2,6.1 46.48,8.38 57.4,8.38 59.82,10.79 U$4.3
N$12
  Top 0.61: X1.3 54.86,4.57 56.13,5.84 58.93,5.84 64.07,10.98 66.89,10.98 69.47,13.56 IC4.12
N$13
  Top 0.61: X1.5 49.78,4.57 51.82,6.6 58.42,6.6 63.75,11.94 66.61,11.94 68.2,13.53 IC4.11
N$14
  Top 0.61: X1.7 44.7,4.75 47.32,7.37 57.91,7.37 63.5,12.95 66.29,12.95 66.93,13.59 IC4.10
N$15
  Top 0.61: X4.2 77.22,4.83 73.28,8.76 IC4.15
N$18
  Top 0.406: 27.6,64.43 C5.1
  Top 0.61: IC1.3 29.97,65.05 29.97,64.52
  Top 1.27: D1.C 21.96,58.17 C1.+ 27.6,63.81 | 27.6,63.81 27.6,64.43 | 27.6,63.81 28.31,64.52 29.97,64.52
N$19
  Top 0.305: IC3.23 29.05,39.28 27.69,40.64 27.69,47.24 30.48,50.04 33.78,50.04 Q1.2
  Top 0.508: R19.2 35.31,55.37 | 35.31,55.37 C3.1 | Q1.2 35.31,55.37
N$20
  Top 0.305: Q1.1 30.23,50.55 27.23,47.55 27.23,39.25 R20.2
  Top 0.508: C4.1 30.23,55.37 | 30.23,55.37 R19.1 | Q1.1 30.23,55.37
N$21
  Top 0.61: X4.3 74.68,5.08 72.01,7.75 IC4.14
N$22  (via drill 0.35)
  other vias: 18.54,53.59 18.54,52.58 18.54,51.56 18.54,50.55 18.54,49.53 18.54,48.51 14.48,48.51 13.46,48.51 16.51,50.55 16.51,51.56 16.51,52.58 16.51,53.59 15.49,48.51 17.53,51.56 17.53,52.58 17.53,53.59 17.53,50.55 17.53,49.53 17.53,48.51 16.51,48.51 16.51,49.53 14.48,54.61 13.46,54.61 13.46,53.59 13.46,52.58 13.46,51.56 13.46,50.55 13.46,49.53 14.48,53.59 14.48,52.58 14.48,51.56 14.48,50.55 14.48,49.53 15.49,49.53 15.49,50.55 15.49,51.56 15.49,52.58 15.49,53.59 15.49,54.61 16.51,54.61 17.53,54.61 18.54,54.61
  pour Top (isolate 0.305, no thermals): 0.76,41.91 0.76,47.24 9.14,55.63 18.8,55.63 18.8,47.75 9.14,47.75 7.87,46.48 7.87,44.45 5.33,41.91
  pour Bottom (isolate 0.305, no thermals): 18.8,55.63 18.8,47.75 8.13,47.75 8.13,55.63
N$23
  Top 0.61: Q3.4 21.32,46.23 R4.2
N$25  (via drill 0.35)
  other vias: 14.48,45.21 18.54,40.13 17.53,40.13 16.51,40.13 15.49,40.13 14.48,40.13 13.46,40.13 16.51,42.16 14.48,41.15 15.49,41.15 14.48,42.16 15.49,42.16 14.48,43.18 15.49,43.18 14.48,44.2 16.51,41.15 16.51,43.18 16.51,44.2 15.49,45.21 13.46,46.23 15.49,44.2 14.48,46.23 15.49,46.23 13.46,45.21 13.46,44.2 13.46,43.18 13.46,42.16 13.46,41.15 16.51,45.21 16.51,46.23 17.53,46.23 18.54,46.23 17.53,45.21 17.53,44.2 17.53,43.18 17.53,42.16 17.53,41.15 18.54,41.15 18.54,42.16 18.54,43.18 18.54,44.2 18.54,45.21
  pour Top (isolate 0.305, no thermals): 0.25,41.15 5.59,41.15 8.64,44.2 8.64,46.23 9.4,46.99 18.8,46.99 18.8,39.12 9.65,39.12 7.37,36.83 0.25,36.83
  pour Bottom (isolate 0.305, no thermals): 8.13,46.99 8.13,39.12 18.8,39.12 18.8,46.99
N$26
  Top 0.61: Q4.4 21.57,37.85 R6.2
N$27
  Top 0.61: IC4.16 74.55,9.78 79.76,4.57 X4.1
N$28  (via drill 0.35)
  Top 0.305: Q4.MB 16.26,34.54
  other vias: 18.54,32.51 18.54,33.53 18.54,34.54 18.54,35.56 18.54,36.58 18.54,37.59 18.54,31.5 17.53,37.59 16.51,37.59 15.49,37.59 14.48,37.59 13.46,37.59 13.46,36.58 13.46,35.56 13.46,34.54 13.46,33.53 13.46,32.51 13.46,31.5 14.48,31.5 15.49,31.5 16.51,31.5 17.53,31.5 17.53,32.51 17.53,33.53 17.53,34.54 17.53,35.56 17.53,36.58 16.51,36.58 16.51,35.56 16.51,34.54 16.51,33.53 16.51,32.51 15.49,32.51 14.48,32.51 14.48,33.53 15.49,33.53 15.49,34.54 14.48,34.54 14.48,35.56 15.49,35.56 15.49,36.58 14.48,36.58
  pour Top (isolate 0.305, no thermals): 0.25,36.07 7.62,36.07 9.91,38.35 18.8,38.35 18.8,30.99 0.25,30.99
  pour Bottom (isolate 0.305, no thermals): 18.8,38.35 18.8,30.99 8.13,30.99 8.13,38.35
N$29
  Top 0.61: Q5.4 22.08,29.21 R8.2
N$30
  Top 0.61: IC4.13 70.74,13.5 67.4,10.16 64.52,10.16 59.94,5.59 X1.1
N$31  (via drill 0.35)
  other vias: 18.54,23.37 18.54,22.35 17.53,22.35 16.51,22.35 15.49,22.35 14.48,22.35 13.46,22.35 18.54,24.38 18.54,25.4 18.54,26.42 18.54,27.43 18.54,28.45 17.53,28.45 16.51,28.45 15.49,28.45 14.48,28.45 13.46,28.45 13.46,27.43 13.46,26.42 13.46,25.4 13.46,24.38 13.46,23.37 14.48,23.37 14.48,24.38 14.48,25.4 14.48,26.42 14.48,27.43 15.49,27.43 15.49,26.42 15.49,25.4 15.49,24.38 15.49,23.37 16.51,23.37 16.51,24.38 16.51,25.4 16.51,26.42 16.51,27.43 17.53,27.43 17.53,26.42 17.53,25.4 17.53,24.38 17.53,23.37
  pour Top (isolate 0.305, no thermals): 0.25,30.23 18.8,30.23 18.8,21.08 9.4,21.08 8.89,21.59 8.89,23.88 6.86,25.91 0.25,25.91
  pour Bottom (isolate 0.305, no thermals): 8.13,30.23 18.8,30.23 18.8,21.08 8.13,21.08
N$32
  Top 0.61: Q6.4 21.83,20.07 R10.2
N$34  (via drill 0.35)
  Top 0.305: 17.03,16 17.27,16
  other vias: 18.54,14.48 18.54,13.46 17.53,13.46 16.51,13.46 15.49,13.46 14.48,13.46 13.46,13.46 13.46,14.48 13.46,15.49 13.46,16.51 13.46,17.53 13.46,18.54 13.46,19.56 14.48,19.56 15.49,19.56 16.51,19.56 17.53,19.56 18.54,19.56 18.54,18.54 18.54,17.53 18.54,16.51 18.54,15.49 17.53,14.48 17.53,15.49 17.53,16.51 17.53,17.53 17.53,18.54 16.51,18.54 16.51,17.53 16.51,16.51 16.51,15.49 16.51,14.48 15.49,14.48 15.49,15.49 15.49,16.51 15.49,17.53 15.49,18.54 14.48,14.48 14.48,15.49 14.48,16.51 14.48,17.53 14.48,18.54
  pour Top (isolate 0.305, no thermals): 0.25,25.15 6.6,25.15 8.13,23.62 8.13,21.34 9.14,20.32 18.8,20.32 18.8,12.45 0.25,12.45
  pour Bottom (isolate 0.305, no thermals): 8.13,20.32 18.8,20.32 18.8,12.45 8.13,12.45
N$35
  Top 0.305: R20.1 28.51,36.64 29.21,37.34 29.21,38.1 29.6,38.49 IC3.24
N$41
  Top 0.61: LED1.A R18.2
PA0
  Top 0.305: IC3.51 51.83,33.77 55.37,30.23 63.75,30.23 70.74,23.24 IC4.4
PA1
  Top 0.305: IC3.50 51.85,32.98 55.12,29.72 63.5,29.72 69.47,23.75 IC4.5
PA2
  Top 0.305: IC3.49 51.88,32.19 54.86,29.21 63.25,29.21 68.2,24.26 IC4.6
PA3
  Top 0.305: IC3.48 44.01,29.69 44.99,28.7 62.99,28.7 66.93,24.77 IC4.7
PA4  (via drill 0.35)
  Top 0.305: v58.17,27.69 57.66,28.19 44.84,28.19 43.22,29.82 IC3.47
  Bottom 0.305: J6.9 88.65,51.56 83.84,51.56 81.43,49.16 81.43,41.58 79.68,39.83 79.68,32.99 77.17,30.48 61.33,30.48 58.53,27.69 v58.17,27.69
PA5  (via drill 0.35)
  Top 0.305: v57.4,26.92 56.64,27.69 44.56,27.69 42.43,29.82 IC3.46
  Bottom 0.305: J6.8 88.65,49.02 83.84,49.02 81.89,47.07 81.89,41.39 80.13,39.64 80.13,32.8 77.36,30.02 61.52,30.02 58.42,26.92 v57.4,26.92
PA6  (via drill 0.35)
  Top 0.305: v56.64,26.16 55.63,27.18 44.29,27.18 41.64,29.82 IC3.45
  Bottom 0.305: J6.7 88.65,46.48 83.84,46.48 82.35,44.99 82.35,41.2 80.59,39.45 80.59,32.61 77.55,29.57 61.71,29.57 58.38,26.24 56.72,26.24 v56.64,26.16
PA7  (via drill 0.35)
  Top 0.305: v55.88,25.4 54.61,26.67 44.01,26.67 40.86,29.82 IC3.44
  Bottom 0.305: J6.6 88.65,43.94 83.84,43.94 82.8,42.91 82.8,41.02 81.05,39.26 81.05,32.42 77.73,29.11 61.9,29.11 58.27,25.48 55.96,25.48 v55.88,25.4
PB0  (via drill 0.35)
  Top 0.305: IC3.10 36.92,45.05 36.32,44.45 v36.07,44.45 | J5.5 83.06,42.67 78.23,37.85 v72.39,37.85
  Bottom 0.305: v36.07,44.45 37.28,43.24 37.28,33.91 41.98,29.21 52.44,29.21 61.08,37.85 v72.39,37.85
PB1(SCK)
  Top 0.305: SV1.4 43.18,51.56 40.64,49.02 36.58,49.02 36.13,48.58 IC3.11
PB2(MOSI)
  Top 0.305: SV1.3 41.91,54.61 41.91,51.05 40.39,49.53 36.32,49.53 35.34,48.55 IC3.12
PB3(MISO)
  Top 0.305: SV1.6 40.64,50.55 40.13,50.04 36.07,50.04 34.56,48.53 IC3.13
PB4  (via drill 0.35)
  Top 0.305: IC3.14 33.77,44.25 34.33,43.69 v35.35,43.69 | J3.5 85.83,41.38 82.54,41.38 78.25,37.08 v73.66,37.08
  Bottom 0.305: v35.35,43.69 36.82,42.21 36.82,33.72 41.79,28.75 52.63,28.75 60.96,37.08 v73.66,37.08
PB5  (via drill 0.35)
  Top 0.305: IC3.15 32.98,44.13 34.18,42.93 v34.69,42.93 | v72.39,36.32 78.23,36.32 82.04,40.13 J5.4
  Bottom 0.305: v34.69,42.93 36.37,41.25 36.37,33.53 41.6,28.3 52.82,28.3 60.84,36.32 v72.39,36.32
PB6  (via drill 0.35)
  Top 0.305: IC3.16 32.19,44.01 v34.04,42.16 | J3.4 85.83,38.84 81.53,38.84 78.17,35.48 v73.66,35.48
  Bottom 0.305: v34.04,42.16 35.91,40.29 35.91,33.34 41.41,27.84 53.01,27.84 60.65,35.48 v73.66,35.48
PB7  (via drill 0.35)
  Top 0.305: IC3.17 31.18,44.01 33.4,41.78 33.4,41.53 v33.27,41.4 | J5.3 81.03,37.59 78.23,34.8 v72.39,34.8
  Bottom 0.305: v33.27,41.4 35.45,39.22 35.45,33.13 41.2,27.38 53.2,27.38 60.61,34.8 v72.39,34.8
PC0
  Top 0.305: IC3.35 33.77,22.85 35.43,21.18 U$1.6
PC1
  Top 0.305: IC3.36 34.54,30.33 34.54,28.7 41.34,21.9 42.87,21.9 43.56,21.21 U$2.6
PC2
  Top 0.305: IC3.37 35.34,28.66 41.65,22.36 43.05,22.36 43.57,21.84 51.05,21.84 51.69,21.21 U$3.6
PC3
  Top 0.305: IC3.38 36.13,28.64 41.95,22.82 43.24,22.82 43.76,22.3 51.24,22.3 51.7,21.84 59.44,21.84 59.82,21.46 U$4.6
PC4  (via drill 0.35)
  Top 0.305: IC3.39 36.92,28.87 v41.66,24.13
  Bottom 0.305: J6.1 88.39,30.99 82.85,30.99 78.68,26.82 62.84,26.82 58.55,22.53 43.3,22.53 41.71,24.13 v41.66,24.13
PC5  (via drill 0.35)
  Top 0.305: IC3.40 37.71,29.1 v42.67,24.13
  Bottom 0.305: J6.2 88.65,33.78 83.72,33.78 82.88,32.94 82.88,31.66 78.49,27.28 62.66,27.28 58.37,22.99 43.86,22.99 42.72,24.13 v42.67,24.13
PC6  (via drill 0.35)
  Top 0.305: IC3.41 38.49,29.32 v43.69,24.13
  Bottom 0.305: J6.3 88.65,36.32 83.58,36.32 82.42,35.16 82.42,31.86 78.3,27.74 62.47,27.74 58.18,23.45 44.42,23.45 43.74,24.13 v43.69,24.13
PC7  (via drill 0.35)
  Top 0.305: IC3.42 39.28,29.55 v44.7,24.13
  Bottom 0.305: J6.4 88.65,38.86 83.72,38.86 81.96,37.1 81.96,32.04 78.11,28.19 62.28,28.19 58.04,23.95 44.88,23.95 v44.7,24.13
PD0  (via drill 0.35)
  Top 0.305: IC3.25 31.89,37.71 32.77,36.83 v33.02,36.83 | J3.2 85.85,33.78 79.5,33.78 78.33,32.61 v73.66,32.61
  Bottom 0.305: v33.02,36.83 34.08,35.77 34.08,32.56 40.63,26.01 53.77,26.01 60.36,32.61 v73.66,32.61
PD1  (via drill 0.35)
  Top 0.305: v32.41,36.07 31.55,36.92 IC3.26 | J5.1 83.74,31.93 v72.39,31.93
  Bottom 0.305: v72.39,31.93 60.33,31.93 53.95,25.55 40.44,25.55 33.62,32.37 33.62,34.85 v32.41,36.07
PD2  (via drill 0.35)
  Top 0.305: v28.96,35.31 28.96,35.51 29.58,36.13 IC3.27 | v33.02,25.4 33.27,25.15 33.27,22.61 34.16,21.72 U$1.7
  Top 0.61: U$1.7 34.16,19.36 35.43,18.09 35.43,18.03 42.16,18.03 | 42.16,18.03 50.42,18.03 | 50.42,18.03 57.91,18.03 58.55,18.67 U$4.7 | U$3.7 50.42,18.03 | U$2.7 42.29,18.16 42.16,18.03
  Bottom 0.305: v33.02,25.4 32.77,25.4 29.72,28.45 29.72,34.54 v28.96,35.31
PD3  (via drill 0.35)
  Top 0.305: v31.75,35.31 31.71,35.34 IC3.28 | J3.1 85.85,31.24 v73.66,31.24
  Bottom 0.305: v31.75,35.31 33.17,33.89 33.17,32.18 40.25,25.09 54.14,25.09 60.29,31.24 v73.66,31.24
PD4
  Top 0.305: IC3.29 27.67,34.56 26.77,35.46 26.77,51.97 25.72,53.02 R3.1
  Top 0.61: R2.1 25.4,54.93 R3.1
PD5  (via drill 0.35)
  Top 0.305: U$4.5 61.09,19.43 v60.45,18.8 | IC3.30 30.33,33.78 v28.96,33.78 | U$1.5 37.02,20.38 v38.1,19.3 | v53.85,18.87 52.96,19.76 U$3.5 | v45.72,18.87 44.83,19.76 U$2.5
  Bottom 0.305: v28.96,33.78 29.21,33.53 29.21,28.19 v38.1,19.3 38.61,18.8 45.72,18.8 | 45.72,18.8 53.85,18.8 | 53.85,18.8 v60.45,18.8 | v53.85,18.87 53.85,18.8 | v45.72,18.87 45.72,18.8
PD6
  Top 0.305: IC3.31 28.6,32.98 26.31,35.27 26.31,43.79 25.97,44.13 R5.1
  Top 0.61: R4.1 25.15,46.04 R5.1
PD7
  Top 0.305: IC3.32 30.14,32.4 28.54,32.4 25.44,35.49 R7.1
  Top 0.61: R7.1 25.08,35.56 R6.1
PE0  (via drill 0.35)
  Top 0.305: v48.23,46.71 48.23,46.46 50.62,44.07 52.2,44.07 | v44.45,46.99 43.69,46.99 43.22,46.52 IC3.2 | IC2.2 52.2,44.07 | 52.2,44.07 v52.07,44.2
  Bottom 0.305: v48.23,46.71 48.23,46.46 46.99,45.21 45.21,45.21 44.45,45.97 v44.45,46.99 | v52.07,44.2 52.07,46.74 55.12,49.78 70.36,49.78 71.37,48.77 X5.2
PE1  (via drill 0.35)
  Top 0.305: IC3.3 42.43,46.75 43.35,47.67 46.31,47.67 51.18,42.8 52.2,42.8 | IC2.3 52.2,42.8 | 52.2,42.8 v52.07,42.67
  Bottom 0.305: v52.07,42.67 51.31,43.43 51.31,46.74 54.86,50.29 72.14,50.29 X5.1
PE2  (via drill 0.35)
  Top 0.305: v73.66,40.05 78.17,40.05 83.08,44.97 83.08,45.73 83.81,46.46 85.83,46.46 J3.7 | IC3.4 41.64,44.48 v41.66,44.46
  Bottom 0.305: v41.66,44.46 41.66,44.15 38.94,41.43 38.94,34.19 42.55,30.58 51.87,30.58 61.34,40.05 v73.66,40.05
PE3
  Top 0.305: IC3.5 40.86,44.23 41.4,43.69 43.69,43.69 44.96,44.96 46.85,44.96 48.51,43.3 48.51,39.12 55.98,31.65 64.4,31.65 74.55,21.5 IC4.1
PE4  (via drill 0.35)
  Top 0.305: IC3.6 40.07,43.88 v39.88,43.69 | J5.6 84.07,45.21 78.23,39.37 v72.39,39.37
  Bottom 0.305: v39.88,43.69 38.35,42.16 38.35,34.13 42.36,30.12 52.06,30.12 61.31,39.37 v72.39,39.37
PE5  (via drill 0.35)
  Top 0.305: IC3.7 39.28,44.7 39.26,44.7 v39.01,44.45 | J3.6 85.83,43.92 83.56,43.92 78.25,38.61 v73.66,38.61
  Bottom 0.305: v39.01,44.45 37.74,43.18 37.74,34.1 42.17,29.67 52.25,29.67 61.19,38.61 v73.66,38.61
PE6  (via drill 0.35)
  Top 0.305: v45.47,45.97 46.48,45.97 49.02,43.43 49.02,39.26 56.17,32.11 64.67,32.11 74.35,22.43 75,22.43 75.95,21.49 75.95,17.27 78.23,14.99 X9.2 | v39.12,47.24 38.49,46.62 IC3.8
  Bottom 0.305: v45.47,45.97 45.47,46.99 44.45,48.01 39.88,48.01 v39.12,47.24
PE7  (via drill 0.35)
  Top 0.305: v46.23,46.74 46.48,46.74 49.53,43.69 49.53,39.39 56.36,32.56 65.03,32.56 71.94,25.65 X8.2 | v38.1,47.24 37.71,46.85 IC3.9
  Bottom 0.305: v46.23,46.74 46.23,46.99 44.7,48.51 39.37,48.51 v38.1,47.24
PF0  (via drill 0.35)
  Top 0.305: IC3.61 42.15,41.64 41.15,40.64 v40.13,40.64 | J5.7 82.55,45.97 82.55,45.21 78.23,40.89 v72.39,40.89
  Bottom 0.305: v40.13,40.64 39.5,40.01 39.5,34.28 42.74,31.04 51.68,31.04 61.54,40.89 v72.39,40.89
PF1  (via drill 0.35)
  Top 0.305: IC3.60 42.38,40.86 41.4,39.88 v40.89,39.88 | J3.8 85.83,49 83.81,49 82.07,47.25 82.07,45.49 78.23,41.66 v73.66,41.66
  Bottom 0.305: v40.89,39.88 39.96,38.94 39.96,34.47 42.93,31.5 51.49,31.5 61.65,41.66 v73.66,41.66
PF2  (via drill 0.35)
  Top 0.305: IC3.59 42.61,40.07 v41.66,39.12 | J5.8 81.61,47.57 81.61,45.72 78.31,42.42 v72.39,42.42
  Bottom 0.305: v41.66,39.12 40.47,37.92 40.47,34.61 43.12,31.95 51.3,31.95 61.77,42.42 v72.39,42.42
PF3  (via drill 0.35)
  Top 0.305: IC3.58 43.09,39.28 41.4,37.59 v41.15,37.59 | J3.9 85.83,51.54 83.81,51.54 81.03,48.75 81.03,45.78 78.42,43.18 v73.66,43.18
  Bottom 0.305: v41.15,37.59 40.97,37.42 40.97,34.75 43.31,32.41 51.11,32.41 61.88,43.18 v73.66,43.18
PF4  (via drill 0.35)
  Top 0.305: IC3.57 43.57,38.49 v41.91,36.83 | J5.9 80.57,49.07 80.57,45.97 78.54,43.94 v72.39,43.94
  Bottom 0.305: v41.91,36.83 41.48,36.4 41.48,34.88 43.5,32.87 50.92,32.87 62,43.94 v72.39,43.94
PF5
  Top 0.305: IC3.56 46.38,37.71 47.5,36.59 50.4,36.59 55.79,31.19 64.21,31.19 73.28,22.12 IC4.2
PF6  (via drill 0.35)
  Top 0.305: IC3.55 43.52,36.92 v42.67,36.07 | R18.1 54.61,38.42 v54.61,38.61
  Bottom 0.305: v42.67,36.07 42.67,34.34 43.69,33.33 50.73,33.33 54.61,37.2 v54.61,38.61
PF7
  Top 0.305: IC3.54 50.2,36.13 55.6,30.73 64.01,30.73 72.01,22.73 IC4.3
PG0
  Top 0.305: IC3.33 31.69,29.83 25.96,29.83 R8.1
  Top 0.61: R9.1 25.33,27.18 R8.1
PG1
  Top 0.305: IC3.34 32.98,29.68 32.51,29.21 27.69,29.21 26.67,28.19 26.67,20.39 R10.1
  Top 0.61: R10.1 26.35,18.41 R11.1
PG2  (via drill 0.35)
  Top 0.305: v55.12,24.64 53.59,26.16 43.73,26.16 40.07,29.82 IC3.43
  Bottom 0.305: J6.5 88.67,41.43 83.86,41.43 81.51,39.07 81.51,32.23 77.92,28.65 62.09,28.65 58.15,24.72 55.2,24.72 v55.12,24.64
PG3  (via drill 0.35)
  Top 0.305: v32.51,40.64 32.51,41.91 31.2,43.22 IC3.18 | J3.3 85.83,36.3 80.51,36.3 78.25,34.04 v73.66,34.04
  Bottom 0.305: v32.51,40.64 35,38.16 35,32.94 41.01,26.92 53.39,26.92 60.5,34.04 v73.66,34.04
PG4  (via drill 0.35)
  Top 0.305: v31.75,39.88 31.75,41.91 31.23,42.43 IC3.19 | J5.2 84.28,35 80.08,35 78.36,33.29 v72.39,33.29
  Bottom 0.305: v31.75,39.88 34.54,37.09 34.54,32.75 40.82,26.47 53.58,26.47 60.4,33.29 v72.39,33.29
RESET  (via drill 0.35)
  Top 0.305: v37.08,48.26 37.34,48.51 40.89,48.51 SV1.2 | IC3.20 29.73,41.64 29.18,42.19 29.18,44.41 29.73,44.96 30.99,44.96 31.5,45.47 31.5,46.74 32.61,47.85 | v33.53,47.5 32.95,47.5 32.61,47.85 | 32.61,47.85 R1.2
  Bottom 0.305: v37.08,48.26 36.83,48.51 34.54,48.51 v33.53,47.5

### Text on the board
tNames: +12V | ISP | +5V | MOSI | GND | RS485 | +12V | SCK | MISO | RESET | ATMEGA2561 | RX | TX | GND | 5V | F1 | UART0 | 12V | F2 | 12V | F3 | 12V | I/O | F4 | 5V | 12V | SCREW | F5 | GND | 12V | Fans | 5V | 2019 | HOPPER | Pudzens | Heaters | Motor | GND | Thermocouples | Krists | T1+ | T1- | T2+ | T2- | T3+ | T3- | T4+ | T4- | 5V | SSR1 | 5V | SSR2 | 5V | SSR3 | 5V | SSR4 | GND | 5V | DIR | ENA | STEP